# EAGLE design domovoy-ff1 (EAGLE 6.1)
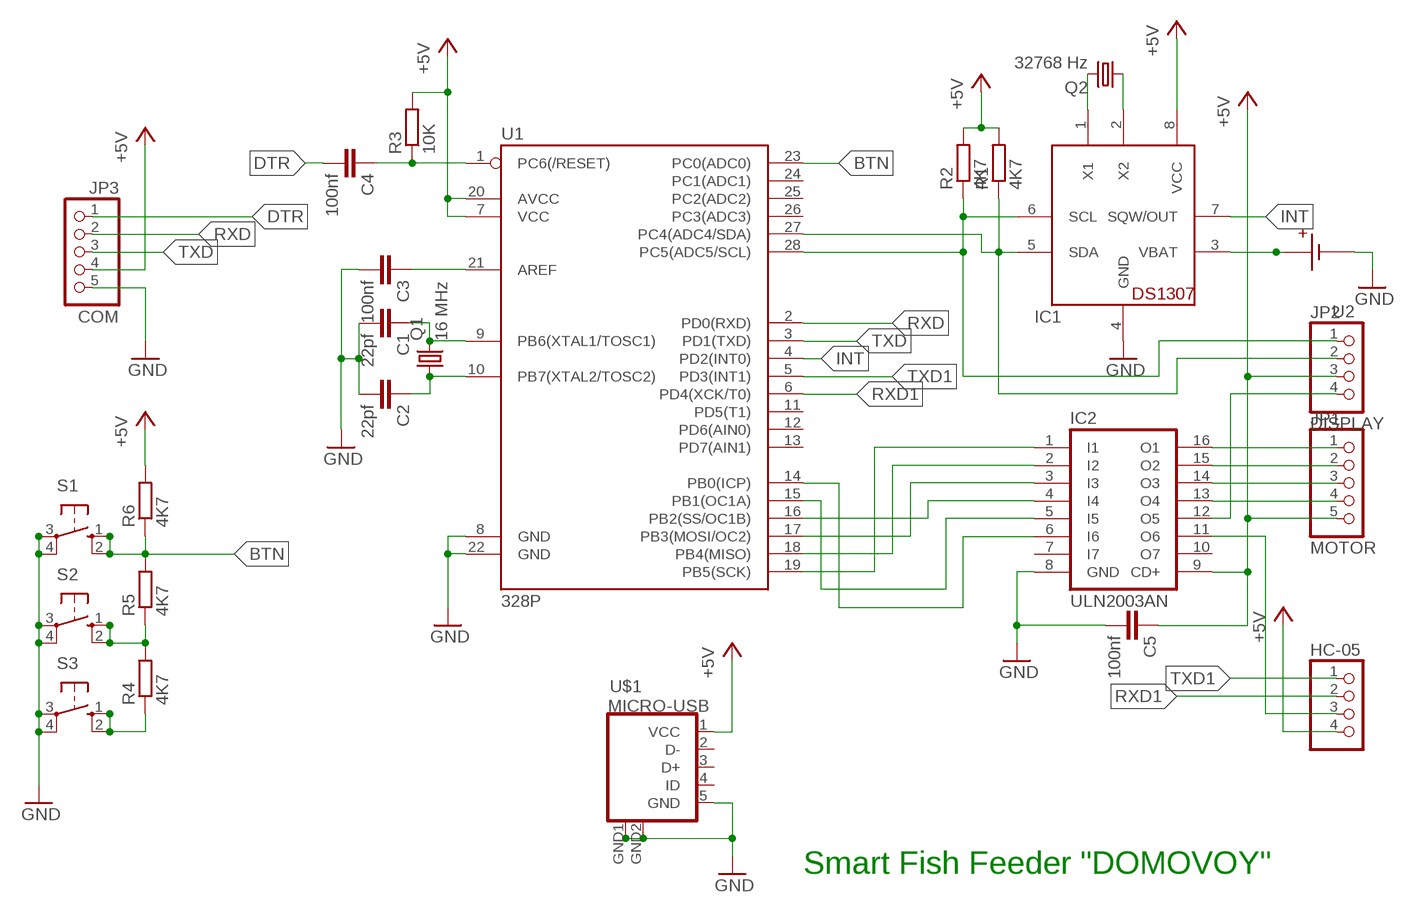
[diagram p0: schematic, sheet 1]

## Parts
C1  22pf  C-EUC1206  [C1206]
C2  22pf  C-EUC1206  [C1206]
C3  100nf  C-EUC1206  [C1206]
C4  100nf  C-EUC1206  [C1206]
C5  100nf  C-EUC1206  [C1206]
HC-05  PINHD-1X4  [1X04]
IC1  DS1307  [DIL08]
IC2  ULN2003AN  [DIL16]
JP1  MOTOR  PINHD-1X5  [1X05]
JP2  DISPLAY  PINHD-1X4  [1X04]
JP3  COM  PINHD-1X5  [1X05]
Q1  16 MHz  CRYSTALHC49S  [HC49/S]
Q2  32768 Hz  CRYSTALTC38H  [TC38H]
R1  4K7  R-EU_R1206  [R1206]
R2  4K7  R-EU_R1206  [R1206]
R3  10K  R-EU_R1206  [R1206]
R4  4K7  R-EU_R1206  [R1206]
R5  4K7  R-EU_R1206  [R1206]
R6  4K7  R-EU_R1206  [R1206]
S1  10-XX  [B3F-10XX]
S2  10-XX  [B3F-10XX]
S3  10-XX  [B3F-10XX]
U1  328P  ATMEGA328P_PDIP  [DIP28]
U2  CR2032-HOLDERSTANDARD  [DIP]
U$1  MICRO-USB  [MICRO-USB]

## Nets
+5V: C5.1 HC-05.4 IC1.8(VCC) IC2.9(CD+) JP1.5 JP2.3 JP3.4 R1.2 R2.2 R3.2 R6.2 U1.7(VCC) U1.20(AVCC) U$1.1(VCC)
BTN: R5.2 R6.1 S1.1(S) S1.2(S1) U1.23(PC0(ADC0))
DTR: C4.2 JP3.1
GND: C1.2 C2.2 C3.2 C5.2 IC1.4(GND) IC2.8(GND) JP3.5 S1.3(P) S1.4(P1) S2.3(P) S2.4(P1) S3.3(P) S3.4(P1) U1.8(GND) U1.22(GND) U2.GND U$1.5(GND) U$1.GND1(GND) U$1.GND2(GND)
INT: IC1.7(SQW/OUT) U1.4(PD2(INT0))
N$1: C1.1 Q1.2 U1.9(PB6(XTAL1/TOSC1))
N$2: C2.1 Q1.1 U1.10(PB7(XTAL2/TOSC2))
N$3: IC2.1(I1) U1.19(PB5(SCK))
N$4: IC2.2(I2) U1.18(PB4(MISO))
N$5: IC2.3(I3) U1.17(PB3(MOSI/OC2))
N$6: IC2.4(I4) U1.16(PB2(SS/OC1B))
N$7: C4.1 R3.1 U1.1(PC6(/RESET))
N$8: IC1.1(X1) Q2.2
N$9: IC1.2(X2) Q2.1
N$10: IC1.6(SCL) JP2.1 R2.1 U1.28(PC5(ADC5/SCL))
N$11: IC1.5(SDA) JP2.2 R1.1 U1.27(PC4(ADC4/SDA))
N$12: C3.1 U1.21(AREF)
N$13: IC2.16(O1) JP1.1
N$14: IC2.15(O2) JP1.2
N$15: IC2.14(O3) JP1.3
N$16: IC2.13(O4) JP1.4
N$17: IC1.3(VBAT) U2.POWER
N$18: IC2.12(O5) JP2.4
N$19: R4.2 R5.1 S2.1(S) S2.2(S1)
N$20: R4.1 S3.1(S) S3.2(S1)
N$21: IC2.5(I5) U1.15(PB1(OC1A))
N$22: HC-05.3 IC2.11(O6)
N$23: IC2.6(I6) U1.14(PB0(ICP))
RXD: JP3.2 U1.2(PD0(RXD))
RXD1: HC-05.2 U1.6(PD4(XCK/T0))
TXD: JP3.3 U1.3(PD1(TXD))
TXD1: HC-05.1 U1.5(PD3(INT1))
Unconnected: IC2.7(I7) IC2.10(O7) U1.11(PD5(T1)) U1.12(PD6(AIN0)) U1.13(PD7(AIN1)) U1.24(PC1(ADC1)) U1.25(PC2(ADC2)) U1.26(PC3(ADC3)) U$1.2(D-) U$1.3(D+) U$1.4(ID)

## Notes on the sheet
- Smart Fish Feeder "DOMOVOY"

## Library data of the parts
C1-C5 = resistor:C-EU: CAPACITOR, European symbol
HC-05 JP2 = pinhead:PINHD-1X4: PIN HEADER
IC1 = adafruit:DS1307: DS1307 Real time clock (RTC) with battery backup ability. Talk to it via i2c
IC2 = uln-udn:ULN2003A: DRIVER ARRAY
JP1 JP3 = pinhead:PINHD-1X5: PIN HEADER
Q1 = crystal:CRYSTAL: CRYSTAL; OC_FARNELL: 1667008; OC_NEWARK: unknown
Q2 = crystal:CRYSTAL: CRYSTAL; OC_FARNELL: unknown; OC_NEWARK: unknown
R1-R6 = resistor:R-EU_: RESISTOR, European symbol
S1-S3 = switch-omron:10-XX: OMRON SWITCH; MPN: B3F-1000; OC_FARNELL: 176432; OC_NEWARK: 36M3542
U1 = SparkFun-IC-Microcontroller:ATMEGA328P_PDIP: Atmel 328P Through hole ATMEGA328P uC used in the Arduino 32kb flash, 1k EEPROM, 2k SRAM Datasheet <http://www.sparkfun.com/datasheets/Components/SMD/ATMega328.pdf> SparkFun Products Storefront component: AVR 28 Pin 20MHz 32K 6A/D - ATMega328P <https://www.sparkfun.com/products/9061> (COM-09061) SparkFun Simon Says - Through-Hole Soldering Kit <https://www.sparkfun.com/products/10547> (KIT-10547) SparkFun Learn to Solder - Simon Says <https://www.sparkfun.com/products/13708> (KIT-13708) SparkFun BigTime Watch Kit <https://www.sparkfun.com/products/11734> (KIT-11734) SparkFun ClockIt <https://www.sparkfun.com/products/10930> (KIT-10930) SparkFun Serial Enabled LCD Kit <https://www.sparkfun.com/products/10097> (LCD-10097) SparkFun Simon Tilts - Through Hole Soldering Kit <https://www.sparkfun.com/products/12634> (KIT-12634) SparkFun Frequency Counter Kit <https://www.sparkfun.com/products/10140> (KIT-10140) FabFM Radio Kit <https://www.sparkfun.com/products/11043> (KIT-11043) SparkFun Binary Blaster Kit <https://www.sparkfun.com/products/12037> (KIT-12037) SparkFun Metro-Gnome <https://www.sparkfun.com/products/9236> (KIT-09236) ATmega328 with Arduino Optiboot (Uno) <https://www.sparkfun.com/products/10524> (DEV-10524); PROD_ID: IC-09136
U2 = kwl:CR2032-HOLDER: CR2032 HOLDER
U$1 = microusb:MICRO-USB: Micro USB B connector

## Board
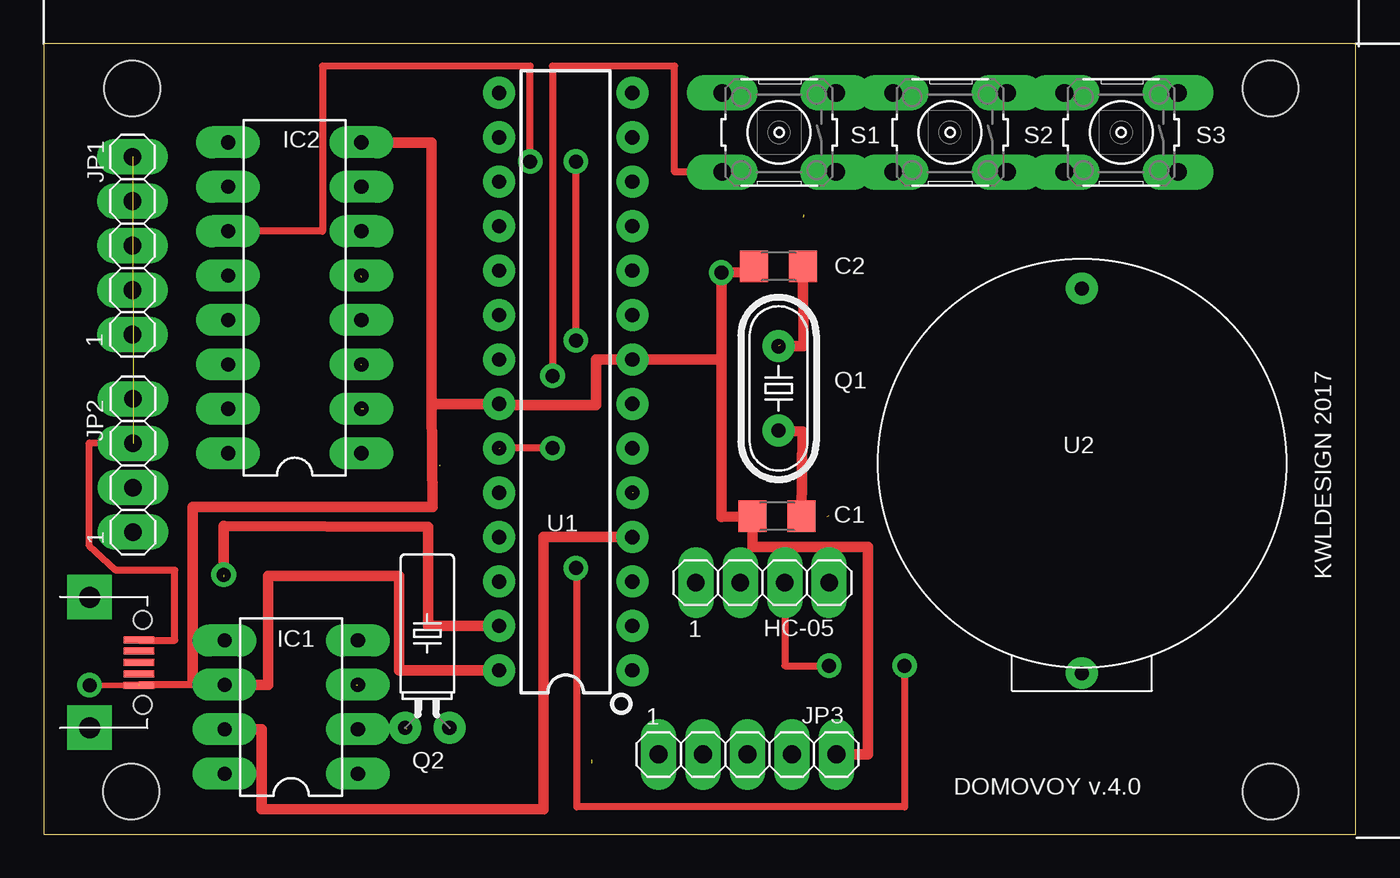
[diagram p1: board, top side]
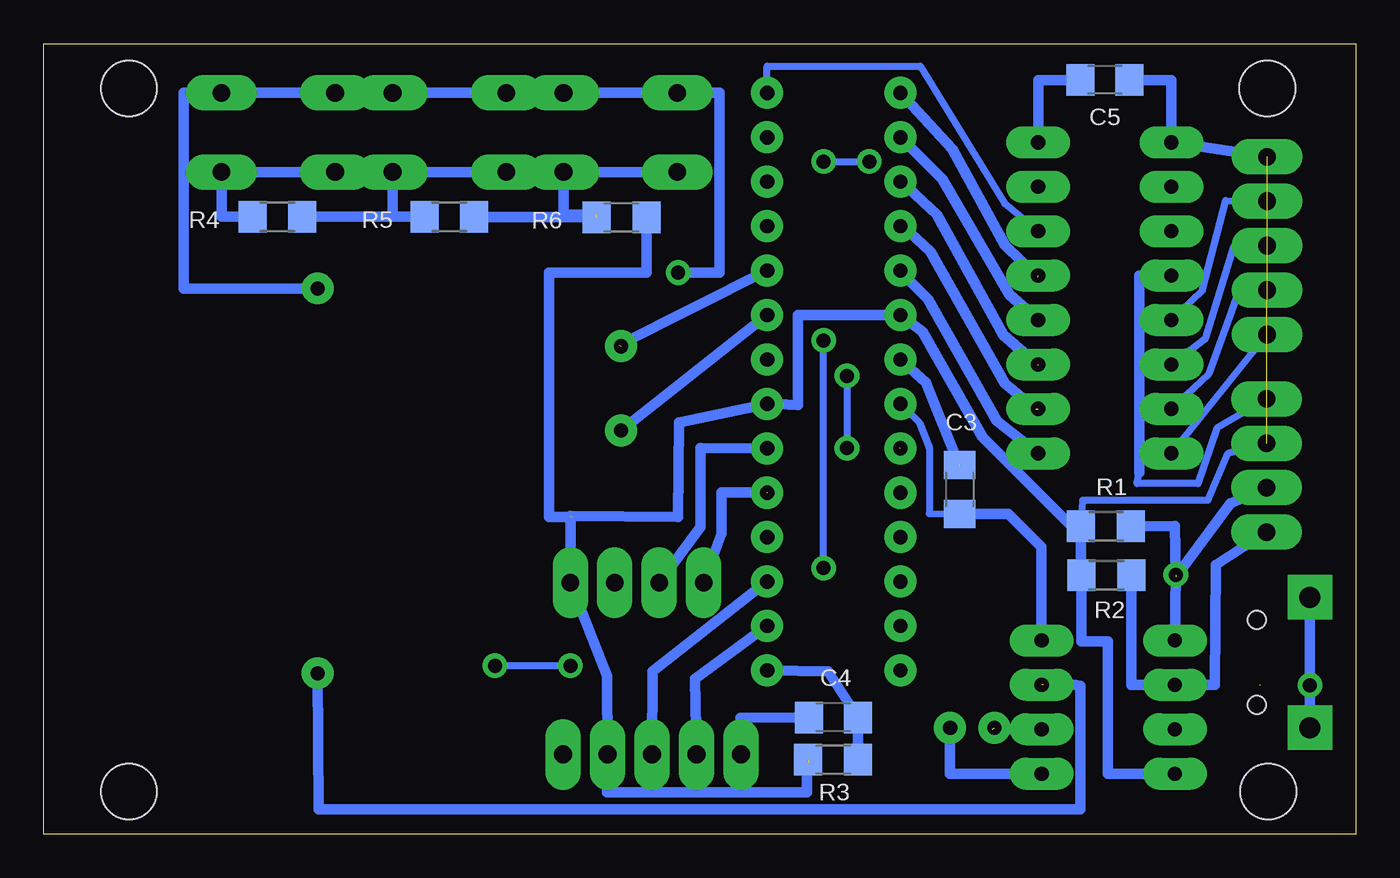
[diagram p2: board, bottom side, seen from below]

Size 75 x 45.19 mm. Coordinates in mm from the lower left corner, seen from the top.
Outline: 0,0 75,0 75,45.19 0,45.19 0,0
Copper layers (1*16): Top 0.035mm / dielectric 1.5mm / Bottom 0.035mm
Design rules: minimum track width 10mil, minimum drill 30mil, track to track 12mil, track to pad 8mil, pad to pad 8mil, via to via 12mil, smd to smd 8mil, copper to edge 40mil, drill to drill 40mil, minimum pad ring 20mil, minimum via ring 12mil, stop-mask expansion 4mil, vias tented up to drill 0mil, thermal gap 10mil
Holes 3.2 mm at 70.13,2.43 70.13,42.64 5,2.43 5.06,42.64

### Footprints (pad centres in the part's own frame; a part is rotated, then mirrored left to right if it is on the bottom)
C1206 = smd 1.6 x 1.8: 1 -1.4,0; 2 1.4,0
1X04 = drill 1.016 long: 1 -3.81,0; 2 -1.27,0; 3 1.27,0; 4 3.81,0
DIL08 = drill 0.813 long: 1 -3.81,-3.81; 2 -1.27,-3.81; 3 1.27,-3.81; 4 3.81,-3.81; 5 3.81,3.81; 6 1.27,3.81; 7 -1.27,3.81; 8 -3.81,3.81
DIL16 = drill 0.813 long: 1 -8.89,-3.81; 2 -6.35,-3.81; 3 -3.81,-3.81; 4 -1.27,-3.81; 5 1.27,-3.81; 6 3.81,-3.81; 7 6.35,-3.81; 8 8.89,-3.81; 9 8.89,3.81; 10 6.35,3.81; 11 3.81,3.81; 12 1.27,3.81; 13 -1.27,3.81; 14 -3.81,3.81; 15 -6.35,3.81; 16 -8.89,3.81
1X05 = drill 1.016 long: 1 -5.08,0; 2 -2.54,0; 3 0,0; 4 2.54,0; 5 5.08,0
HC49/S = drill 0.813: 1 -2.413,0; 2 2.413,0
TC38H = drill 0.813: 1 -1.27,0; 2 1.27,0
R1206 = smd 1.6 x 1.803: 1 -1.422,0; 2 1.422,0
B3F-10XX = drill 1.016 long: 1 -3.251,2.261; 2 3.251,2.261; 3 -3.251,-2.261; 4 3.251,-2.261
DIP28 = drill 0.813 pad 1.626: 1 -16.51,-3.81; 2 -13.97,-3.81; 3 -11.43,-3.81; 4 -8.89,-3.81; 5 -6.35,-3.81; 6 -3.81,-3.81; 7 -1.27,-3.81; 8 1.27,-3.81; 9 3.81,-3.81; 10 6.35,-3.81; 11 8.89,-3.81; 12 11.43,-3.81; 13 13.97,-3.81; 14 16.51,-3.81; 15 16.51,3.81; 16 13.97,3.81; 17 11.43,3.81; 18 8.89,3.81; 19 6.35,3.81; 20 3.81,3.81; 21 1.27,3.81; 22 -1.27,3.81; 23 -3.81,3.81; 24 -6.35,3.81; 25 -8.89,3.81; 26 -11.43,3.81; 27 -13.97,3.81; 28 -16.51,3.81
DIP = drill 0.8: GND -11,0; POWER 11,0
MICRO-USB = smd 0.4 x 1.75: 1 -1.3,4.525; 2 -0.65,4.525; 3 0,4.525; 4 0.65,4.525; 5 1.3,4.525 | drill 1.2 pad 2.54 square: GND1 -3.725,1.7; GND2 3.725,1.7 | hole 1.05: -2.425,4.73; 2.425,4.73

### Placement (x,y rotation side)
C1  41.92,18.17 180 top
C2  42.01,32.45 180 top
C3  22.65,19.71 270 bottom
C4  29.86,6.68 180 bottom
C5  14.34,43.12 180 bottom
HC-05  41.09,14.38 0 top
IC1  14.15,7.26 90 top
IC2  14.35,30.66 90 top
JP1  5.07,33.64 90 top
JP2  5.1,21.08 90 top
JP3  40.23,4.56 0 top
Q1  42.01,25.48 270 top
Q2  21.92,6.08 0 top
R1  14.28,17.59 180 bottom
R2  14.26,14.81 180 bottom
R3  29.89,4.26 180 bottom
R4  61.64,35.29 0 bottom
R5  51.81,35.29 0 bottom
R6  41.98,35.26 0 bottom
S1  42.03,40.12 180 top
S2  51.81,40.12 180 top
S3  61.59,40.12 180 top
U1  29.84,25.87 90 top
U2  59.35,20.2 270 top
U$1  0.92,9.81 270 top

### Tracks (layer width: path | path; a pad name or v marks a point on that pad's centre or on a via)
+5V  (3 unrouted)
  Top 0.406: U$1.1 5.45,11.08 7.49,11.08 7.49,15.09 4.13,15.09 2.6,16.48 2.6,22.39 JP2.3
  Bottom 0.406: JP2.3 7.3,21.75 8.45,19.09 15.62,19.09 R1.2
  Bottom 0.61: 31.3,4.04 31.37,4.04 31.37,2.38 42.8,2.38 JP3.4 42.8,9.05 HC-05.4 44.9,18.2 38.73,18.13 38.67,23.53 U1.7 31.88,24.55 31.88,29.68 U1.20 24.77,28.74 21.34,22.7 16.22,17.59 R1.2 15.7,14.81 R2.2 15.69,11.02 14.16,11.02 14.16,3.45 IC1.8 | C5.1 10.54,43.12 IC2.9 JP1.5 | R6.2 40.55,32.1 46.1,32.1 46.1,18.13 44.77,18.13
BTN  (via drill 0.8 pad 0.41, 0.8 pad 0.81)  (3 unrouted)
  Top 0.406: S1.2 36.07,37.86 36.07,43.91 29.08,43.91 v29.08,26.2 | v29.08,22.07 26.1,22.07
  Bottom 0.406: v29.08,26.2 v29.08,22.07
  Bottom 0.61: S1.2 S1.1 45.28,35.41 43.43,35.41 43.37,35.41 | R5.2 50.39,35.28 43.43,35.28
DTR
  Bottom 0.61: C4.2 35.18,6.64 JP3.1
GND  (via drill 0.8, 0.8 pad 0.41)  (1 unrouted)
  Top 0.305: U$1.5 v2.62,8.51
  Top 0.406: 8.51,8.67 8.51,8.54 5.46,8.54
  Top 0.61: C2.2 40.2,32.14 v38.73,32.1 38.73,27.14 | 38.73,27.14 38.73,18.13 C1.2 40.52,16.42 47.12,16.42 47.12,4.56 JP3.5 | 38.73,27.14 U1.8 31.56,27.14 31.56,24.55 26.03,24.55 U1.22 22.16,24.6 | 22.16,24.6 22.16,39.53 18.16,39.53 IC2.8 | 22.16,24.6 22.23,18.7 8.51,18.7 8.51,8.67
  Bottom 0.406: U1.22 24.96,23.53 24.38,22.07 24.38,18.32 C3.2
  Bottom 0.61: C3.2 19.86,18.31 17.97,16.42 17.97,11.09 IC1.4 | IC2.8 18.16,43.12 C5.2 | U2.GND 66.99,31.2 66.99,42.39 S3.3 S3.4 S2.3 S2.4 S1.3 S1.4 36.39,42.38 36.39,32.1 v38.73,32.1 | U$1.GND2 v2.62,8.51 U$1.GND1
INT
  Top 0.61: U1.4 28.57,16.98 28.57,1.43 12.45,1.43 12.45,6.01 10.34,6.01 IC1.7
N$1
  Top 0.61: C1.1 43.37,23.02 Q1.2
  Bottom 0.61: U1.9 Q1.2
N$2  (1 unrouted)
  Top 0.61: C2.1 43.43,27.91 Q1.1
  Bottom 0.61: U1.10 42.1,27.98 42.16,27.98
N$3
  Bottom 0.61: U1.19 26.03,32.16 24.45,30.58 20.51,23.62 IC2.1
N$4  (1 unrouted)
  Bottom 0.61: U1.18 25.9,34.76 24.32,33.31 20.07,25.75 18.29,24.29
N$5  (1 unrouted)
  Bottom 0.61: U1.17 25.96,37.3 23.94,35.41 20.13,28.55 18.16,26.83 18.1,26.77
N$6
  Bottom 0.61: U1.16 23.62,37.44 19.81,30.86 IC2.4
N$7
  Bottom 0.61: U1.1 30.16,9.31 C4.1 R3.1
N$8
  Bottom 0.61: IC1.1 23.19,3.45 Q2.2
N$9  (1 unrouted)
  Bottom 0.61: IC1.2 20.77,6.01
N$10
  Top 0.61: U1.28 20.32,9.36 20.32,14.77 12.84,14.77 12.84,8.53 IC1.6
  Bottom 0.61: R2.1 12.84,8.53 IC1.6 8.06,8.54 8,15.4 JP2.1
N$11  (via drill 0.8 pad 0.81)  (1 unrouted)
  Top 0.61: U1.27 21.97,11.9 21.97,17.56 10.29,17.62 v10.29,14.83
  Bottom 0.61: R1.1 10.35,17.62 v10.29,14.83 IC1.5 | JP2.2 7.18,18.9 10.29,14.7
N$12  (1 unrouted)
  Bottom 0.61: U1.21 24.57,25.82 22.67,21.05
N$13
  Bottom 0.406: IC2.16 JP1.1
N$14
  Bottom 0.406: IC2.15 8.38,26.33 6.6,31.21 JP1.2
N$15
  Bottom 0.406: IC2.14 8.57,28.36 6.99,33.56 JP1.3
N$16
  Bottom 0.406: IC2.13 8.76,31.09 7.43,36.23 JP1.4
N$17  (1 unrouted)
  Bottom 0.61: U2.POWER 59.28,1.43 15.75,1.43 15.75,8.48 16.07,8.54 17.84,8.53
N$18
  Bottom 0.406: JP2.4 7.94,23.21 9.02,20.04 12.51,20.04 12.38,20.67
  Bottom 0.61: IC2.12 12.38,31.93 12.38,20.67
N$19
  Bottom 0.61: S2.2 S2.1 55.06,35.29 53.98,35.29 | 53.98,35.29 R5.1 | R4.2 53.98,35.29
N$20
  Bottom 0.61: S3.2 S3.1 64.84,35.29 R4.1
N$21  (1 unrouted)
  Bottom 0.61: U1.15 23.05,39.15 20.07,33.69 18.16,31.85
N$22  (via drill 0.8)
  Top 0.406: HC-05.3 42.36,9.62 v44.9,9.62 | v49.21,9.62 49.21,1.56 30.48,1.56 30.48,15.21 v30.42,15.21 | v30.42,28.23 v30.42,38.45 | v27.81,38.45 27.81,43.91 15.94,43.91 15.94,34.47 IC2.11
  Bottom 0.406: v44.9,9.62 v49.21,9.62 | v30.42,15.21 30.42,28.17 v30.42,28.23 | v30.42,38.45 30.48,38.45 v27.81,38.45
N$23
  Bottom 0.406: U1.14 33.65,43.91 24.89,43.91 20.07,36.04 IC2.6
RXD
  Bottom 0.61: JP3.2 37.78,8.86 U1.2
RXD1
  Bottom 0.61: HC-05.2 37.47,17.56 37.47,22.07 U1.6
TXD
  Bottom 0.61: JP3.3 40.2,9.31 U1.3
TXD1  (1 unrouted)
  Bottom 0.61: HC-05.1 36.26,17.18 36.26,19.53 U1.5

### Text on the board
tNames: 1 | 1 | KWLDESIGN 2017 | 1 | 1 | DOMOVOY v.4.0